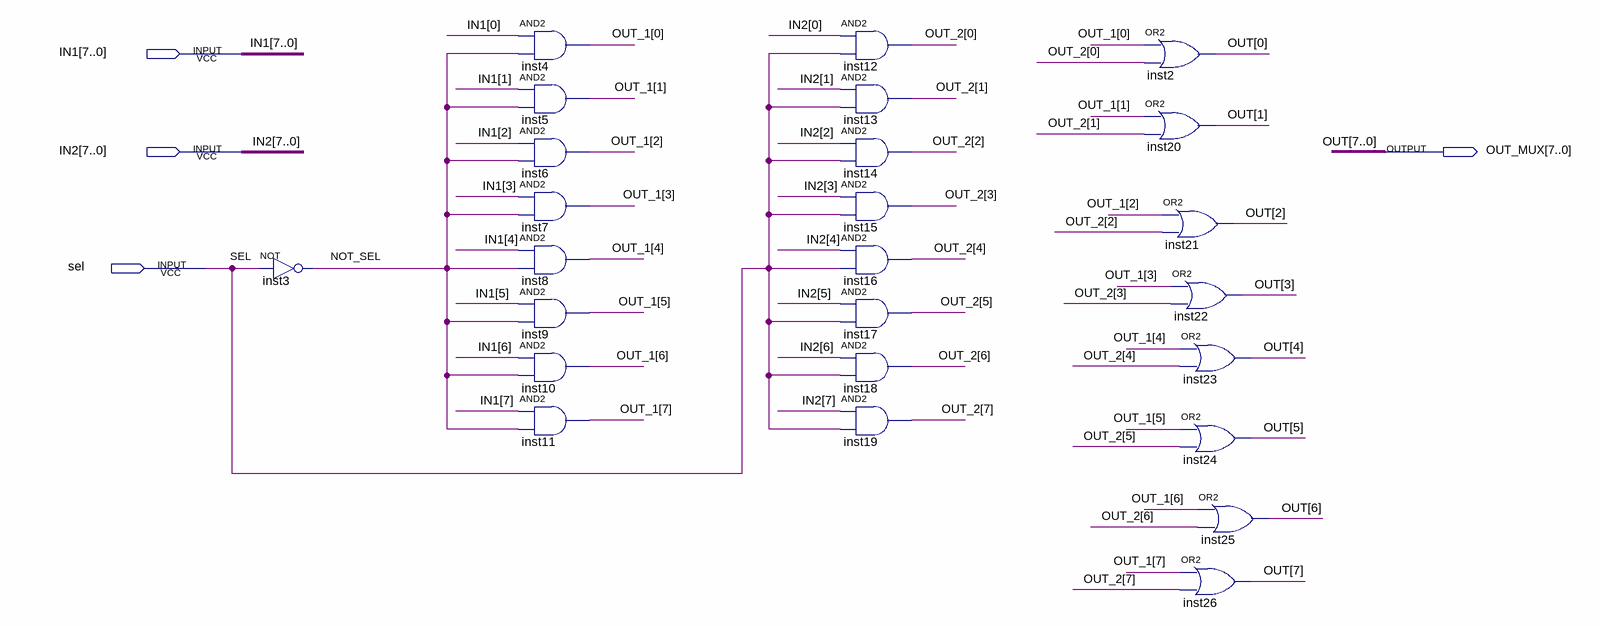
[diagram p0: schematic sheet]
// Quartus schematic MUX_8_BIT.bdf as structural Verilog: 25 symbols, 4 pins
module MUX_8_BIT (
  input  [7:0] IN1,
  input  [7:0] IN2,
  input  sel,
  output [7:0] OUT_MUX
);

  wire NOT_SEL;
  wire [7:0] OUT_1, OUT_2;

  not inst3 (NOT_SEL, sel);
  and inst4 (OUT_1[0], IN1[0], NOT_SEL);
  and inst5 (OUT_1[1], IN1[1], NOT_SEL);
  and inst6 (OUT_1[2], IN1[2], NOT_SEL);
  and inst7 (OUT_1[3], IN1[3], NOT_SEL);
  and inst8 (OUT_1[4], IN1[4], NOT_SEL);
  and inst9 (OUT_1[5], IN1[5], NOT_SEL);
  and inst10 (OUT_1[6], IN1[6], NOT_SEL);
  and inst11 (OUT_1[7], IN1[7], NOT_SEL);
  and inst12 (OUT_2[0], IN2[0], sel);
  and inst13 (OUT_2[1], IN2[1], sel);
  and inst14 (OUT_2[2], IN2[2], sel);
  and inst15 (OUT_2[3], IN2[3], sel);
  and inst16 (OUT_2[4], IN2[4], sel);
  and inst17 (OUT_2[5], IN2[5], sel);
  and inst18 (OUT_2[6], IN2[6], sel);
  and inst19 (OUT_2[7], IN2[7], sel);
  or inst2 (OUT_MUX[0], OUT_1[0], OUT_2[0]);
  or inst20 (OUT_MUX[1], OUT_1[1], OUT_2[1]);
  or inst21 (OUT_MUX[2], OUT_1[2], OUT_2[2]);
  or inst22 (OUT_MUX[3], OUT_1[3], OUT_2[3]);
  or inst23 (OUT_MUX[4], OUT_1[4], OUT_2[4]);
  or inst24 (OUT_MUX[5], OUT_1[5], OUT_2[5]);
  or inst25 (OUT_MUX[6], OUT_1[6], OUT_2[6]);
  or inst26 (OUT_MUX[7], OUT_1[7], OUT_2[7]);

  // Other names for the same wires on the sheet: OUT[7:0] = OUT_MUX
endmodule
